# Altium schematic sheet V10_031K6_20200425.SchDoc
size A4
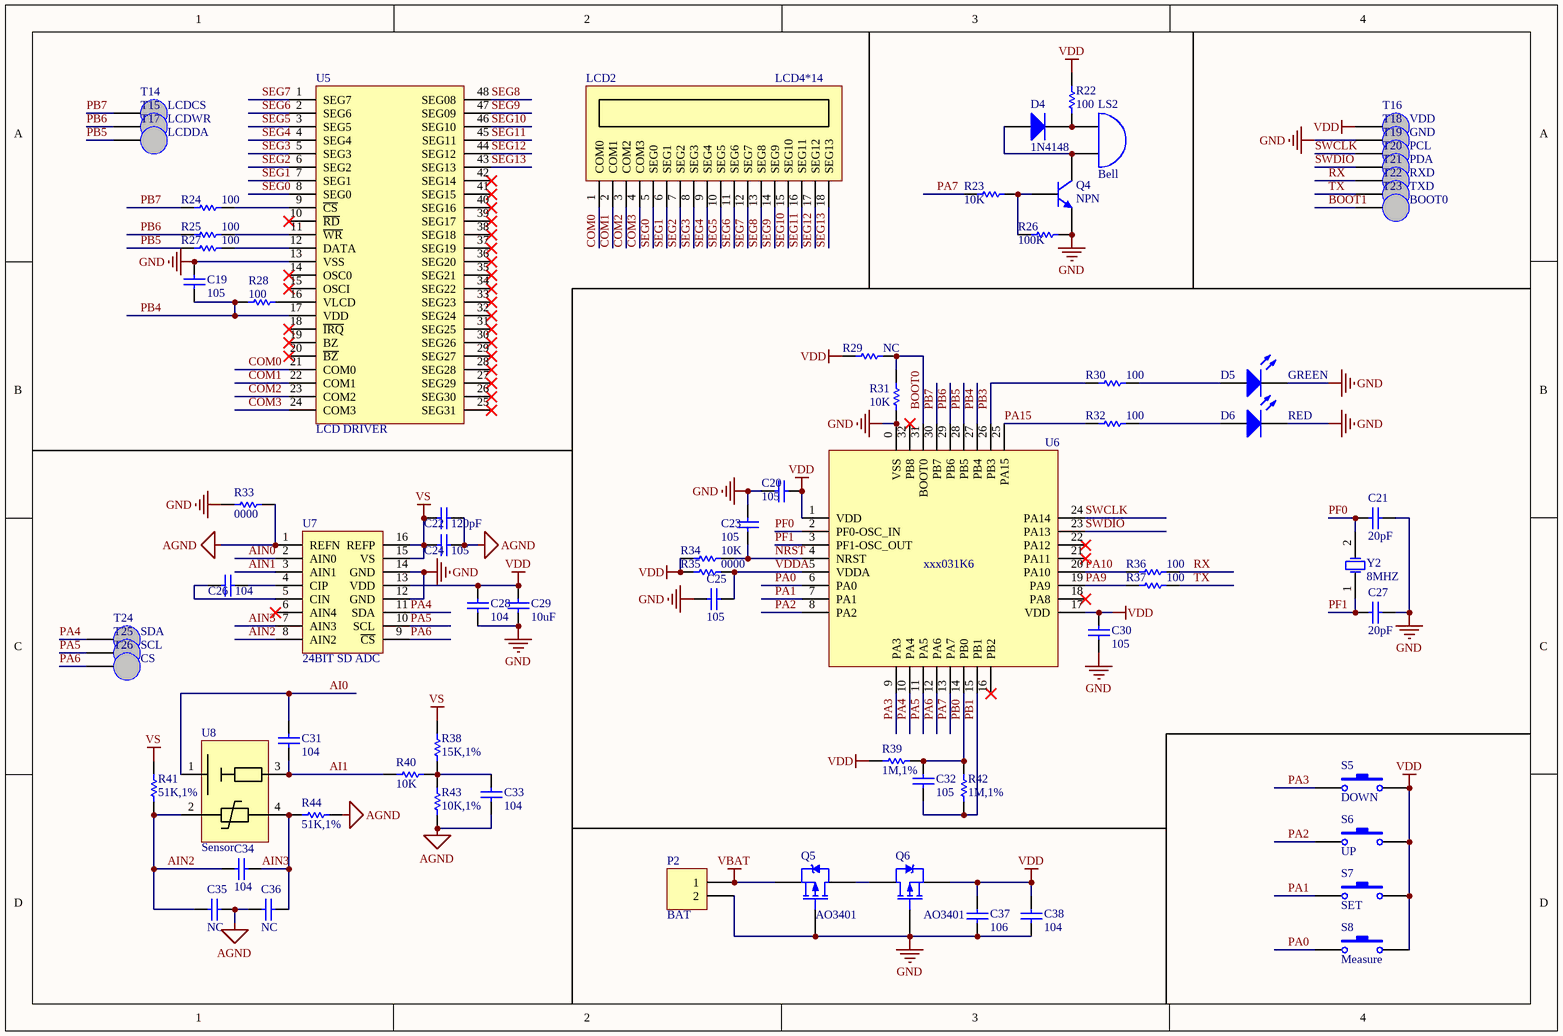
[diagram p0: V10_031K6_20200425.SchDoc]

## Parts
C19  105  [RAD-0.3]
C20  105  [RAD-0.3]
C21  20pF  [RAD-0.3]
C22  120pF  [RAD-0.3]
C23  105  [RAD-0.3]
C24  105  [RAD-0.3]
C25  105  [RAD-0.3]
C26  104  [RAD-0.3]
C27  20pF  [RAD-0.3]
C28  104  [RAD-0.3]
C29  10uF  [RAD-0.3]
C30  105  [RAD-0.3]
C31  104  [RAD-0.3]
C32  105  [RAD-0.3]
C33  104  [RAD-0.3]
C34  104  [RAD-0.3]
C35  NC  [RAD-0.3]
C36  NC  [RAD-0.3]
C37  106  [RAD-0.3]
C38  104  [RAD-0.3]
D4  1N4148  [SMC]
D5  GREEN  [LED-0]
D6  RED  [LED-0]
LCD2  LCD4*14
LS2  Bell  [PIN2]
P2  BAT  [HDR1X2]
Q4  NPN  [TO-226-AA]
Q5  AO3401  [TO-220AB]
Q6  AO3401  [TO-220AB]
R22  100  [AXIAL-0.3]
R23  10K  [AXIAL-0.3]
R24  100  [AXIAL-0.3]
R25  100  [AXIAL-0.3]
R26  100K  [AXIAL-0.3]
R27  100  [AXIAL-0.3]
R28  100  [AXIAL-0.3]
R29  NC  [AXIAL-0.3]
R30  100  [AXIAL-0.3]
R31  10K  [AXIAL-0.3]
R32  100  [AXIAL-0.3]
R33  0000  [AXIAL-0.3]
R34  10K  [AXIAL-0.3]
R35  0000  [AXIAL-0.3]
R36  100  [AXIAL-0.3]
R37  100  [AXIAL-0.3]
R38  15K,1%  [AXIAL-0.3]
R39  1M,1%  [AXIAL-0.3]
R40  10K  [AXIAL-0.3]
R41  51K,1%  [AXIAL-0.3]
R42  1M,1%  [AXIAL-0.3]
R43  10K,1%  [AXIAL-0.3]
R44  51K,1%  [AXIAL-0.3]
S5  DOWN  [SPST-2]
S6  UP  [SPST-2]
S7  SET  [SPST-2]
S8  Measure  [SPST-2]
T14  LCDCS
T15  LCDWR
T16  VDD
T17  LCDDA
T18  GND
T19  PCL
T20  PDA
T21  RXD
T22  TXD
T23  BOOT0
T24  SDA
T25  SCL
T26  CS
U5  LCD DRIVER
U6  xxx031K6
U7  24BIT SD ADC
U8  Sensor
Y2  8MHZ  [R38]

## Nets
AGND: C22.1 C24.1 C33.1 C35.1 C36.2 R33.1 R43.1 R44.2 U7.1(REFN)
GND: C19.2 C20.1 C21.1 C23.1 C25.1 C27.1 C28.2 C29.2 C30.1 C37.1 C38.1 D5.2(K) D6.2(K) P2.2 Q4.3(E) Q5.1(G) Q6.1(G) R26.2 R31.1 R33.2 T18.1(TEST) U5.13(VSS) U6.0(VSS) U7.12(GND) U7.14(GND)
VBAT: P2.1 Q5.3(S)
VDD: C20.2 C28.1 C29.1 C30.2 C37.2 C38.2 Q6.3(S) R22.2 R29.1 R34.1 R35.1 R39.2 S5.2 S6.2 S7.2 S8.2 T16.1(TEST) U6.1(VDD) U6.17(VDD) U7.13(VDD)
VS: C22.2 C24.2 R38.2 R41.2 U7.15(VS) U7.16(REFP)
AI0: C31.2 U8.1
AI1: C31.1 R40.2 U8.3(-1)
AIN0: U7.2(AIN0)
AIN1: U7.3(AIN1)
AIN2: C34.1 C35.2 R41.1 U7.8(AIN2) U8.2
AIN3: C34.2 C36.1 R44.1 U7.7(AIN3) U8.4(-0)
BOOT0: R29.2 R31.2 U6.31(BOOT0)
BOOT1: T23.1(TEST)
COM0: LCD2.1(COM0) U5.21(COM0)
COM1: LCD2.2(COM1) U5.22(COM1)
COM2: LCD2.3(COM2) U5.23(COM2)
COM3: LCD2.4(COM3) U5.24(COM3)
NRST: C23.2 R34.2 U6.4(NRST)
PA0: S8.1 U6.6(PA0)
PA1: S7.1 U6.7(PA1)
PA2: S6.1 U6.8(PA2)
PA3: S5.1 U6.9(PA3)
PA4: T24.1(TEST) U6.10(PA4) U7.11(SDA)
PA5: T25.1(TEST) U6.11(PA5) U7.10(SCL)
PA6: T26.1(TEST) U6.12(PA6) U7.9(~{CS})
PA7: R23.1 U6.13(PA7)
PA9: R37.1 U6.19(PA9)
PA10: R36.1 U6.20(PA10)
PA15: R32.1 U6.25(PA15)
PB0: C32.2 R39.1 R42.2 U6.14(PB0)
PB1: C32.1 R42.1 U6.15(PB1)
PB3: R30.1 U6.26(PB3)
PB4: C19.1 R28.1 U5.17(VDD) U6.27(PB4)
PB5: R27.1 T17.1(TEST) U6.28(PB5)
PB6: R25.1 T15.1(TEST) U6.29(PB6)
PB7: R24.1 T14.1(TEST) U6.30(PB7)
PF0: C21.2 U6.2(PF0-OSC_IN) Y2.2(OSC2)
PF1: C27.2 U6.3(PF1-OSC_OUT) Y2.1(OSC1)
RX: R36.2 T21.1(TEST)
SEG0: LCD2.5(SEG0) U5.8(SEG0)
SEG1: LCD2.6(SEG1) U5.7(SEG1)
SEG2: LCD2.7(SEG2) U5.6(SEG2)
SEG3: LCD2.8(SEG3) U5.5(SEG3)
SEG4: LCD2.9(SEG4) U5.4(SEG4)
SEG5: LCD2.10(SEG5) U5.3(SEG5)
SEG6: LCD2.11(SEG6) U5.2(SEG6)
SEG7: LCD2.12(SEG7) U5.1(SEG7)
SEG8: LCD2.13(SEG8) U5.48(SEG08)
SEG9: LCD2.14(SEG9) U5.47(SEG09)
SEG10: LCD2.15(SEG10) U5.46(SEG10)
SEG11: LCD2.16(SEG11) U5.45(SEG11)
SEG12: LCD2.17(SEG12) U5.44(SEG12)
SEG13: LCD2.18(SEG13) U5.43(SEG13)
SWCLK: T19.1(TEST) U6.24(PA14)
SWDIO: T20.1(TEST) U6.23(PA13)
TX: R37.2 T22.1(TEST)
VDDA: C25.2 R35.2 U6.5(VDDA)
NetC26_1: C26.1 U7.4(CIP)
NetC26_2: C26.2 U7.5(CIN)
NetC33_2: C33.2 R38.1 R40.1 R43.2
NetD4_1: D4.1(A) LS2.2(B) Q4.1(C)
NetD4_2: D4.2(K) LS2.1(A) R22.1
NetD5_1: D5.1(A) R30.2
NetD6_1: D6.1(A) R32.2
NetQ4_2: Q4.2(B) R23.2 R26.1
NetQ5_2: Q5.2(D) Q6.2(D)
NetR24_2: R24.2 U5.9(~{CS})
NetR25_2: R25.2 U5.11(~{WR})
NetR27_2: R27.2 U5.12(DATA)
NetR28_2: R28.2 U5.16(VLCD)

Not connected (* = marked no-connect by the designer): U5 10(~{RD})* 14(OSC0)* 15(OSCI)* 18(~{IRQ})* 19(BZ)* 20(~{BZ})* 25(SEG31)* 26(SEG30)* 27(SEG29)* 28(SEG28)* 29(SEG27)* 30(SEG26)* 31(SEG25)* 32(SEG24)* 33(SEG23)* 34(SEG22)* 35(SEG21)* 36(SEG20)* 37(SEG19)* 38(SEG18)* 39(SEG17)* 40(SEG16)* 41(SEG15)* 42(SEG14)*; U6 16(PB2)* 18(PA8)* 21(PA11)* 22(PA12)* 32(PB8)*; U7 6(AIN4)*

## Library data of the parts
C19-C38 = Cap: Capacitor; Value: 100pF; Published: 8-Jun-2000; LatestRevisionDate: 17-Jul-2002; LatestRevisionNote: Re-released for DXP Platform.; PackageReference: RAD-0.3; Publisher: Altium Limited; PackageDescription: Radial Cap, Thru-Hole; 2 Leads; 0.3 in Pin Spacing
D4 = Diode: Default Diode; Published: 8-Jun-2000; LatestRevisionDate: 17-Jul-2002; LatestRevisionNote: Re-released for DXP Platform.; PackageVersion: Sep-1996; PackageReference: SMC; Publisher: Altium Limited; PackageDescription: DO-214-AB/SMC; 2 C-Bend Leads; Body 7.9 x 5.9 mm, inc. leads (LxW); Code_JEDEC: DO-214-AB
D5 D6 = LED0: Typical INFRARED GaAs LED; Published: 8-Jun-2000; LatestRevisionDate: 08-Jul-2005; LatestRevisionNote: Mech Layer 1 removed.; PackageReference: LED-0; Publisher: Altium Limited; PackageDescription: LED; 2 Leads
LCD2 = LCD-4*14: LCD Displayer
LS2 = Bell: Electrical Bell; Published: 24-Mar-1999; LatestRevisionDate: 17-Jul-2002; LatestRevisionNote: Re-released for DXP Platform.; PackageReference: PIN2; Publisher: Altium Limited
P2 = Header 2: Header, 2-Pin; LatestRevisionDate: 17-Jul-2002; LatestRevisionNote: Re-released for DXP Platform.; Publisher: Altium Limited
Q4 = NPN: NPN Bipolar Transistor; Published: 8-Jun-2000; LatestRevisionDate: 17-Jul-2002; LatestRevisionNote: Re-released for DXP Platform.; PackageReference: TO-226-AA; Publisher: Altium Limited; PackageDescription: TO, Flat Index; 3 In-Line, Axial Leads; Body Dia. 4.8mm; Leads 0.55 x 0.51 mm (max); Code_JEDEC: TO-226-AA
Q5 Q6 = PMOS-2: P-Channel Power MOSFET; Note: Pin 4 not drawn and electrically connected to Pin 2.; Published: 8-Jun-2000; LatestRevisionDate: 17-Jul-2002; LatestRevisionNote: Re-released for DXP Platform.; DatasheetVersion: PD-9.390D; PackageVersion: Feb-1997; PackageReference: TO-220AB; Publisher: Altium Limited; PackageDescription: TO, Thru-Hole, Vertical, Heatsink Mounted; 3 In-Line Leads; Pitch 2.54 mm; ComponentLink1Description: Manufacturer Link; ComponentLink1URL: http://www.irf.com/
R22-R44 = Res1: Resistor; Value: 1K; Published: 8-Jun-2000; LatestRevisionDate: 17-Jul-2002; LatestRevisionNote: Re-released for DXP Platform.; PackageReference: AXIAL-0.3; Publisher: Altium Limited; PackageDescription: Axial Device, Thru-Hole; 2 Leads; 0.3 in Pin Spacing
S5-S8 = SW-PB: Switch; Published: 24-Mar-1999; LatestRevisionDate: 17-Jul-2002; LatestRevisionNote: Re-released for DXP Platform.; PackageReference: SPST-2; Publisher: Altium Limited; PackageDescription: Switch; 2 Leads
T14-T26 = TestPad
U5 = SC1621: 32X4 LCD Driver
U6 = STM32F031K6: CM0 UFQFPN32
U7 = CS1259B: chipsea SD ADC
U8 = Sensor: ntc ,TP
Y2 = XTAL: Crystal Oscillator; Published: 8-Jun-2000; LatestRevisionDate: 17-Jul-2002; LatestRevisionNote: Re-released for DXP Platform.; PackageReference: R38; Publisher: Altium Limited; PackageDescription: Crystal, Thru-Hole; 2 Leads; Body 3.1 x 8.2 mm (Dia.xH)